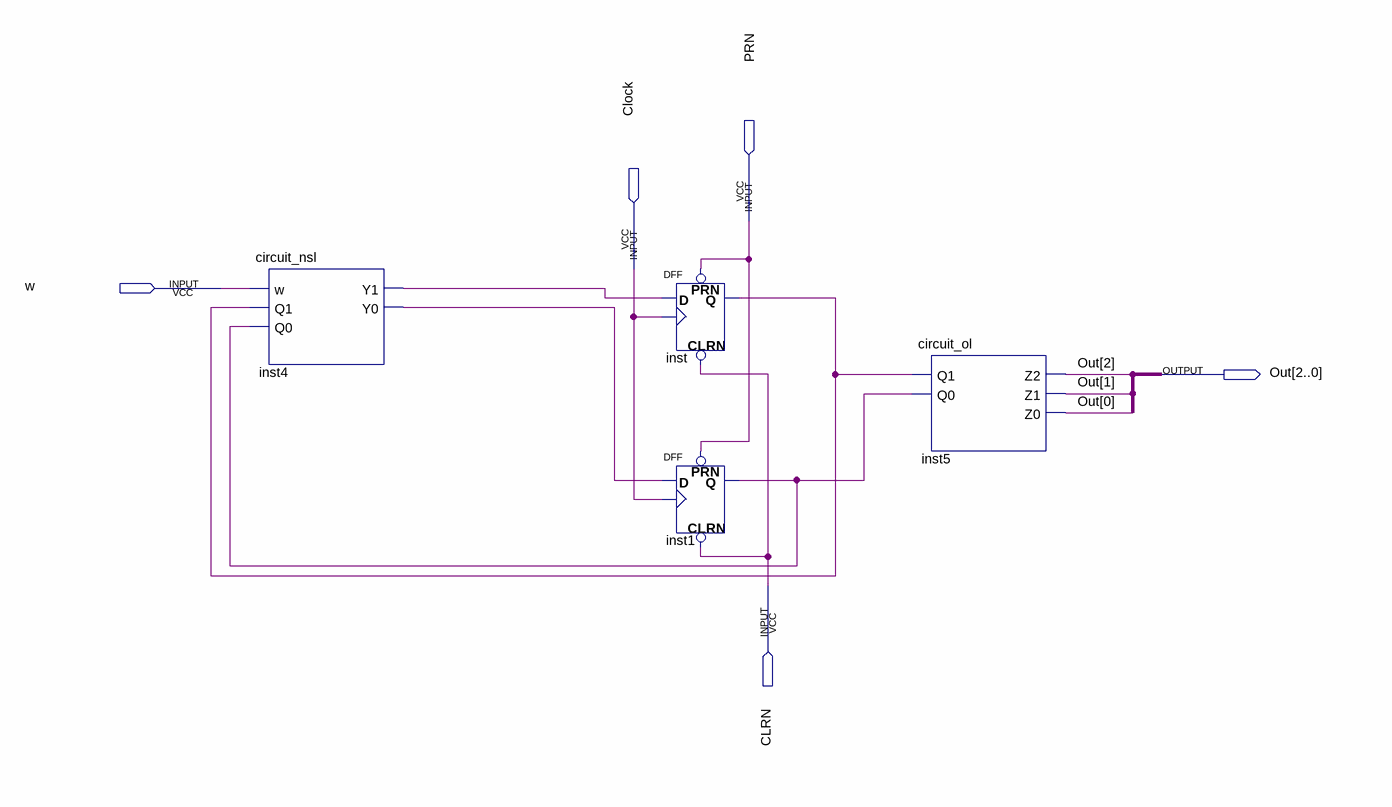
[diagram p0: schematic sheet]
// Quartus schematic lab11step2.bdf as structural Verilog: 4 symbols, 5 pins
module lab11step2 (
  input  PRN,
  input  Clock,
  input  w,
  input  CLRN,
  output [2:0] Out
);

  wire inst1_q, inst4_y0, inst4_y1, inst_q;

  circuit_nsl inst4 (.w(w), .Q1(inst_q), .Q0(inst1_q), .Y1(inst4_y1), .Y0(inst4_y0));
  DFF inst (.CLRN(CLRN), .CLK(Clock), .D(inst4_y1), .PRN(PRN), .Q(inst_q));
  DFF inst1 (.CLRN(CLRN), .CLK(Clock), .D(inst4_y0), .PRN(PRN), .Q(inst1_q));
  circuit_ol inst5 (.Q1(inst_q), .Q0(inst1_q), .Z2(Out[2]), .Z1(Out[1]), .Z0(Out[0]));
endmodule
